# Altium project SolarPanels.PrjPCB
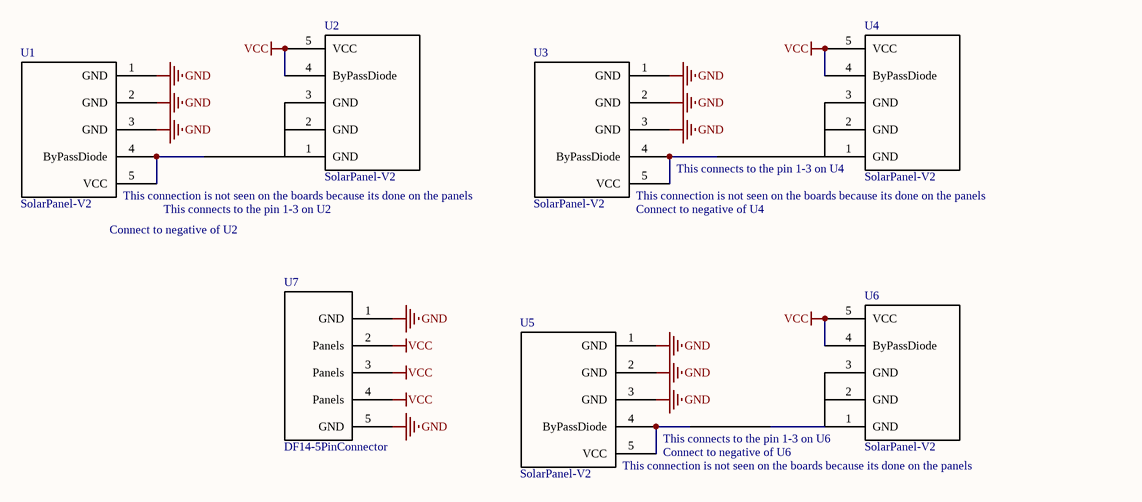
[diagram p0: SolarPanels.SchDoc]
1 sheet, 7 parts. Net scope: global (net labels, ports and power ports of the same name join across sheets).
Board file: SolarPanels.PcbDoc

## Sheet SolarPanels.SchDoc: Solar Panels 6 Cell
size A; DrawnBy: Zeng; Organization: UTAT SS; DocumentNumber: 1; Revision: 2; SheetNumber: 1; SheetTotal: 1

### Parts
U1  SolarPanel-V2  [SolarPanel_V2_1]
U2  SolarPanel-V2  [SOLARPANEL_V2_2]
U3  SolarPanel-V2  [SolarPanel_V2_1]
U4  SolarPanel-V2  [SOLARPANEL_V2_2]
U5  SolarPanel-V2  [SolarPanel_V2_1]
U6  SolarPanel-V2  [SOLARPANEL_V2_2]
U7  DF14-5PinConnector  [DF14-5P-1.25H(55)]

### Nets
GND: U1.1(GND) U1.2(GND) U1.3(GND) U3.1(GND) U3.2(GND) U3.3(GND) U5.1(GND) U5.2(GND) U5.3(GND) U7.1(GND) U7.5(GND)
VCC: U2.4(ByPassDiode) U2.5(VCC) U4.4(ByPassDiode) U4.5(VCC) U6.4(ByPassDiode) U6.5(VCC) U7.2(Panels) U7.3(Panels) U7.4(Panels)
NetU1_4: U1.4(ByPassDiode) U1.5(VCC)
NetU3_4: U3.4(ByPassDiode) U3.5(VCC)
NetU5_4: U5.4(ByPassDiode) U5.5(VCC)

Not connected (* = marked no-connect by the designer): U2 1(GND) 2(GND) 3(GND); U4 1(GND) 2(GND) 3(GND); U6 1(GND) 2(GND) 3(GND)

### Notes on the sheet
- (near U1) This connection is not seen on the boards because its done on the panels
- (near U3) This connection is not seen on the boards because its done on the panels
- (near U4) This connects to the pin 1-3 on U4
- (near U1) Connect to negative of U2
- This connects to the pin 1-3 on U2
- (near U3) Connect to negative of U4
- (near U5) This connection is not seen on the boards because its done on the panels
- Connect to negative of U6
- (near U6) This connects to the pin 1-3 on U6